# EAGLE design Analog_module_free (EAGLE 7.4.0)
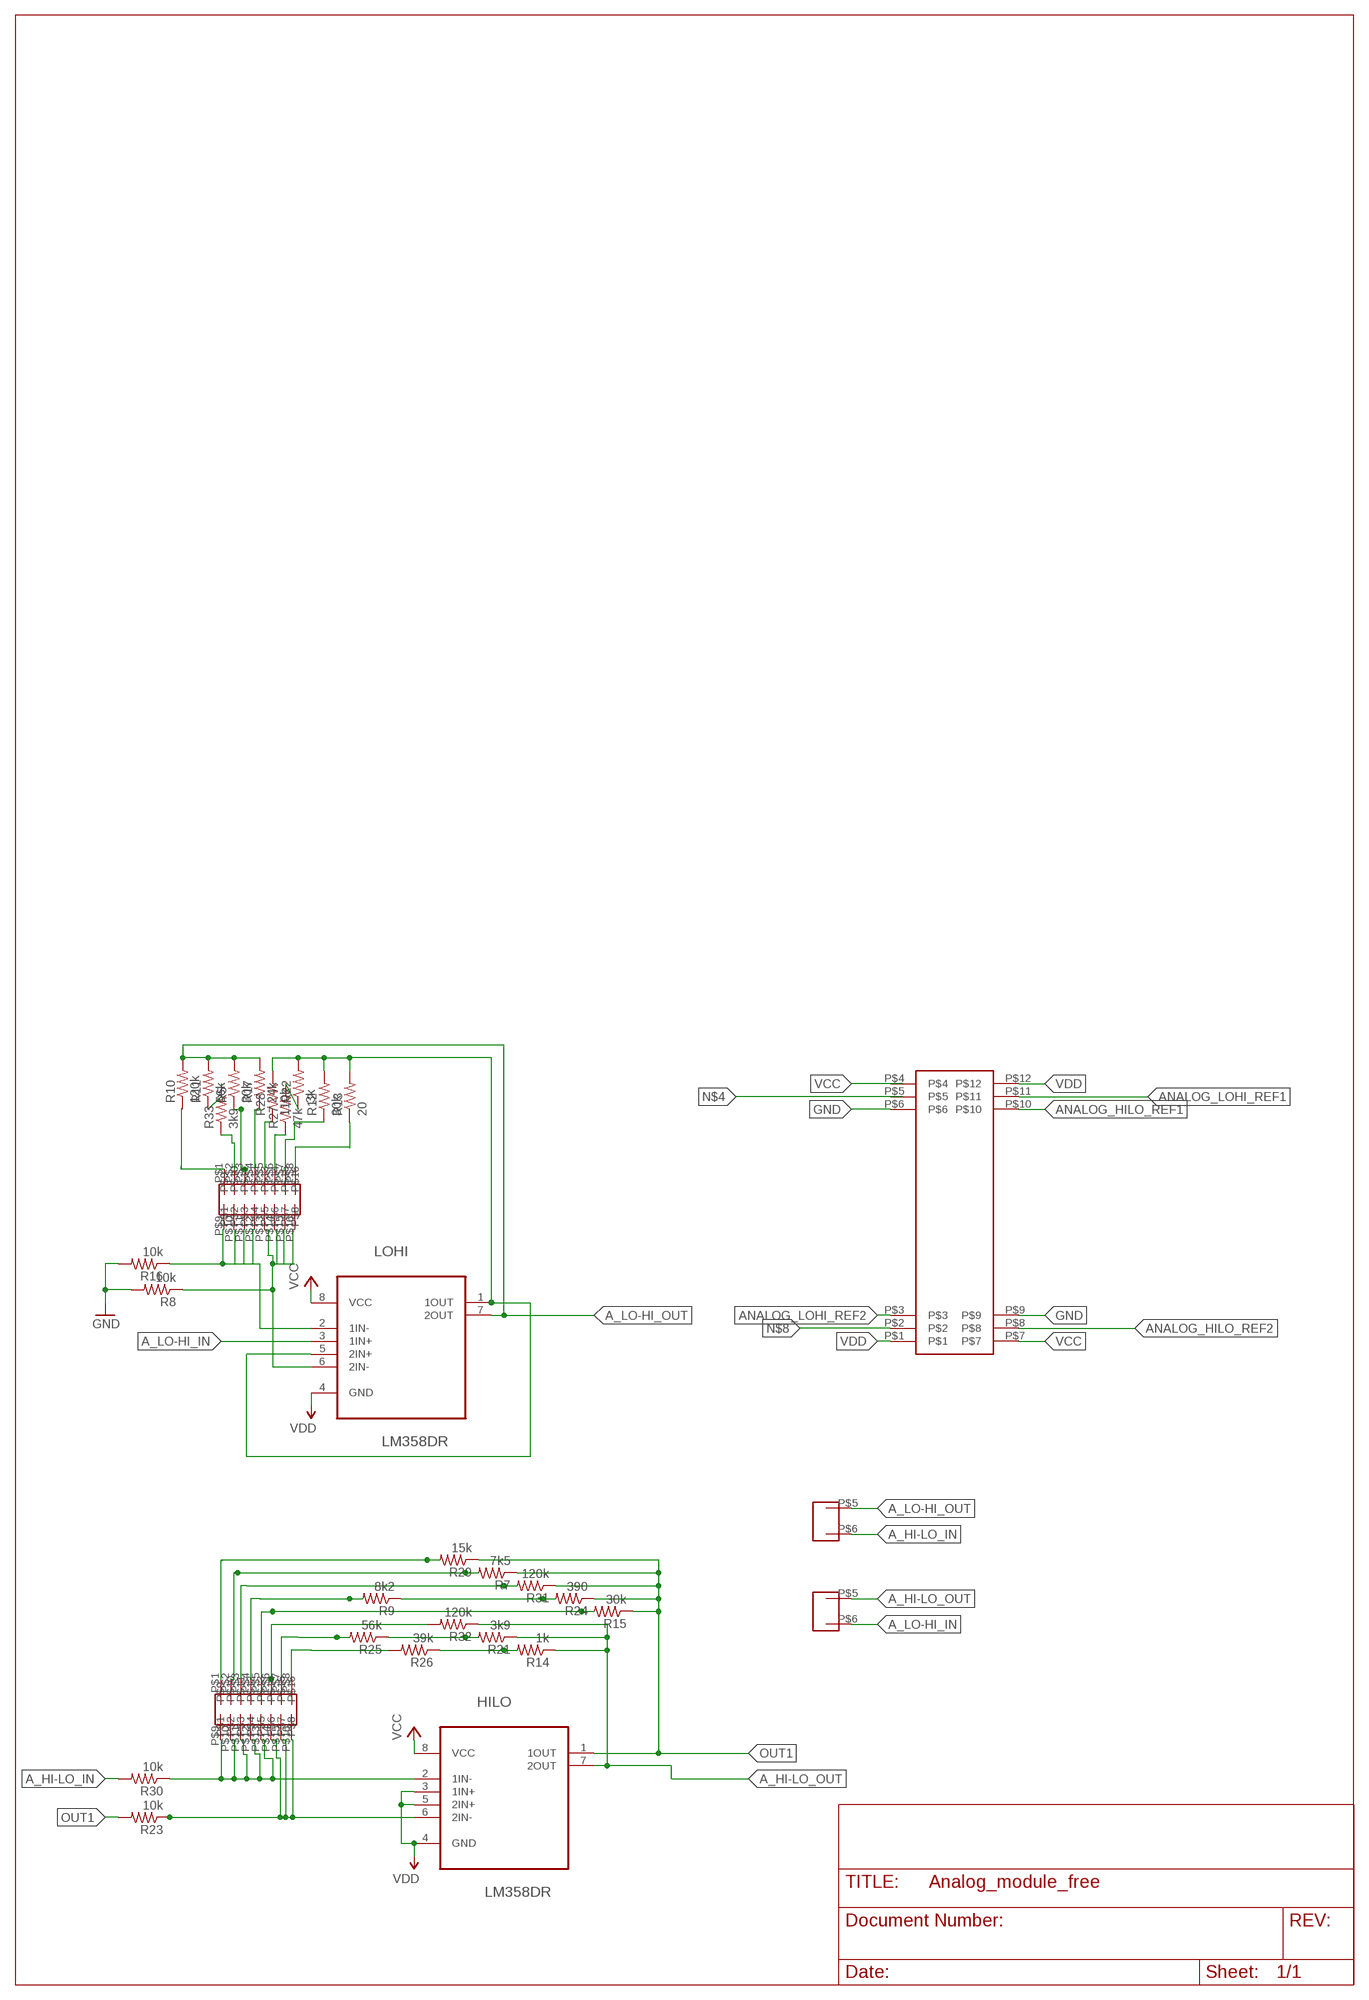
[diagram p0: schematic, sheet 1]

## Parts
HILO  LM358DR  [SOIC127P600X175-8N]
LOHI  LM358DR  [SOIC127P600X175-8N]
R5  30k  R-US_R0805  [R0805]
R7  7k5  R-US_R0805  [R0805]
R8  10k  R-US_R0805  [R0805]
R9  8k2  R-US_R0805  [R0805]
R10  120k  R-US_R0805  [R0805]
R11  56k  R-US_R0805  [R0805]
R12  30k  R-US_R0805  [R0805]
R13  20  R-US_R0805  [R0805]
R14  1k  R-US_R0805  [R0805]
R15  30k  R-US_R0805  [R0805]
R16  10k  R-US_R0805  [R0805]
R17  24k  R-US_R0805  [R0805]
R21  3k9  R-US_R0805  [R0805]
R22  3k  R-US_R0805  [R0805]
R23  10k  R-US_R0805  [R0805]
R24  390  R-US_R0805  [R0805]
R25  56k  R-US_R0805  [R0805]
R26  39k  R-US_R0805  [R0805]
R27  47k  R-US_R0805  [R0805]
R28  110k  R-US_R0805  [R0805]
R29  15k  R-US_R0805  [R0805]
R30  10k  R-US_R0805  [R0805]
R31  120k  R-US_R0805  [R0805]
R32  120k  R-US_R0805  [R0805]
R33  3k9  R-US_R0805  [R0805]
U$1  MODULE_CONNECTOR  [MODULE_CONNECTOR]
U$2  5.08PITCHTERMINAL  [10KPL508]
U$3  5.08PITCHTERMINAL  [10KPL508]
U$4  USCO_8PIN_SWITCH  [USCO_8PIN_SWITCH]
U$5  USCO_8PIN_SWITCH  [USCO_8PIN_SWITCH]

## Nets
A_HI-LO_IN: R30.2 U$2.P$6
A_HI-LO_OUT: HILO.7(2OUT) R14.1 R21.1 R32.1 U$3.P$5
A_LO-HI_IN: LOHI.3(1IN+) U$3.P$6
A_LO-HI_OUT: LOHI.7(2OUT) R5.2 R10.2 R11.2 R17.2 U$2.P$5
ANALOG_HILO_REF1: U$1.P$10
ANALOG_HILO_REF2: U$1.P$8
ANALOG_LOHI_REF1: U$1.P$11
ANALOG_LOHI_REF2: U$1.P$3
GND: R8.2 R16.2 U$1.P$6 U$1.P$9
N$8: U$1.P$2
N$10: HILO.2(1IN-) R30.1
N$13: R27.1
N$21: R13.1
N$22: R29.2
N$23: LOHI.1(1OUT) LOHI.5(2IN+) R12.2 R13.2 R22.2 R28.2
N$24: R7.2
N$26: R31.2 U$5.P$3
N$27: R9.2
N$28: R15.2
N$29: R32.2 U$5.P$6
N$30: HILO.6(2IN-) R23.1
N$31: R25.2
N$32: R26.2
N$34: R14.2 R26.1
N$36: R21.2 R25.1
N$37: R9.1 R24.2
N$38: R22.1 R27.2
N$41: R11.1 R33.2
N$46: LOHI.2(1IN-) R16.1
N$48: U$5.P$7
N$49: U$5.P$8
N$50: LOHI.6(2IN-) R8.1
N$51: U$4.P$5
N$53: U$4.P$7
OUT1: HILO.1(1OUT) R7.1 R15.1 R23.2 R24.1 R29.1 R31.1
VCC: HILO.8(VCC) LOHI.8(VCC) U$1.P$7
VDD: HILO.3(1IN+) HILO.4(GND) HILO.5(2IN+) LOHI.4(GND) U$1.P$1 U$1.P$12
Unconnected: R5.1 R10.1 R12.1 R17.1 R28.1 R33.1 U$1.P$4 U$1.P$5 U$4.P$1 U$4.P$2 U$4.P$3 U$4.P$4 U$4.P$6 U$4.P$8 U$4.P$9 U$4.P$10 U$4.P$11 U$4.P$12 U$4.P$13 U$4.P$14 U$4.P$15 U$4.P$16 U$5.P$1 U$5.P$2 U$5.P$4 U$5.P$5 U$5.P$9 U$5.P$10 U$5.P$11 U$5.P$12 U$5.P$13 U$5.P$14 U$5.P$15 U$5.P$16

## Library data of the parts
HILO LOHI = Texas Instruments_By_element14_Batch_1:LM358DR: OPERATIONAL AMPLIFIERS; MPN: LM358DR; OC_FARNELL: 1831865; OC_NEWARK: 34K7599; PACKAGE: SOIC-8; SUPPLIER: Texas Instruments
R5 R7-R17 R21-R33 = rcl:R-US_: RESISTOR, American symbol
U$1 = UADIVOLECO_module_connector:MODULE_CONNECTOR
U$2 U$3 = ruuviliitin_2pin:5.08PITCHTERMINAL
U$4 U$5 = USCO_8PIN_SWITCH:USCO_8PIN_SWITCH

## Board
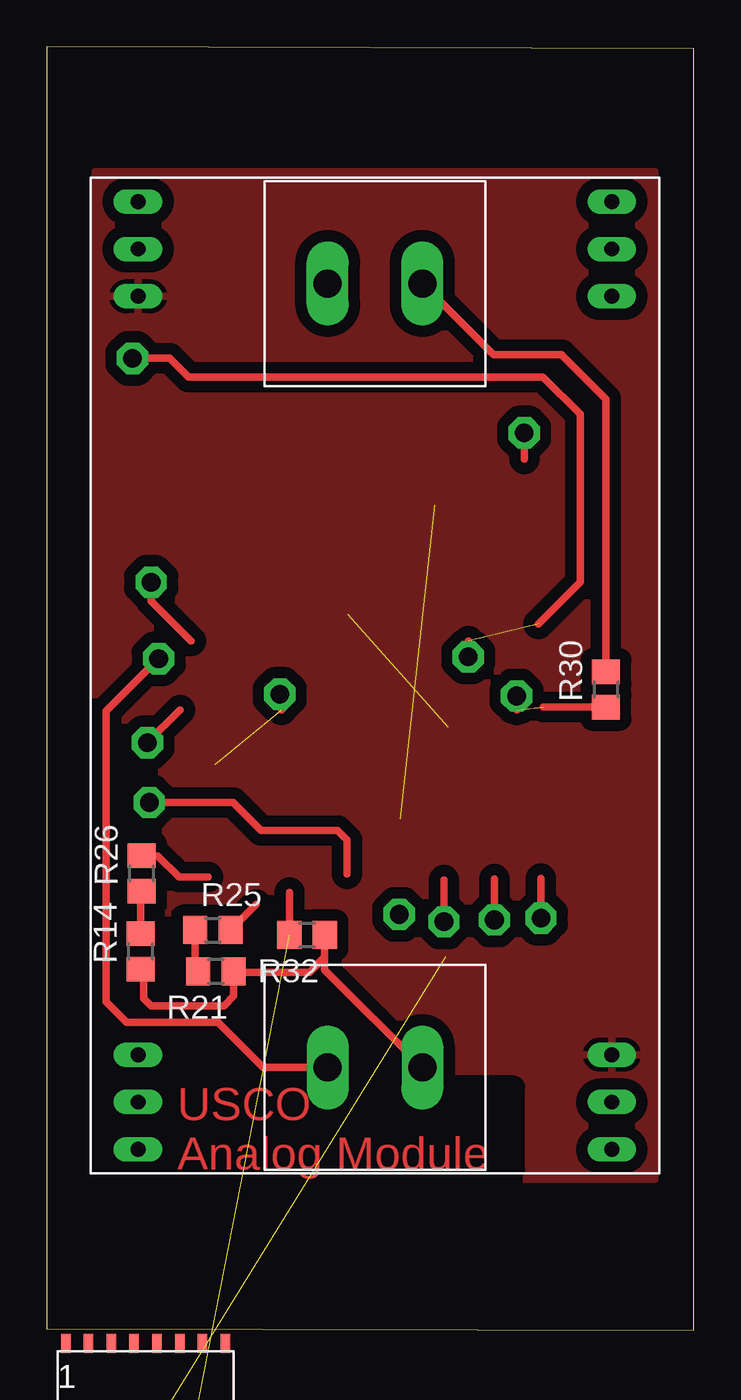
[diagram p1: board, top side]
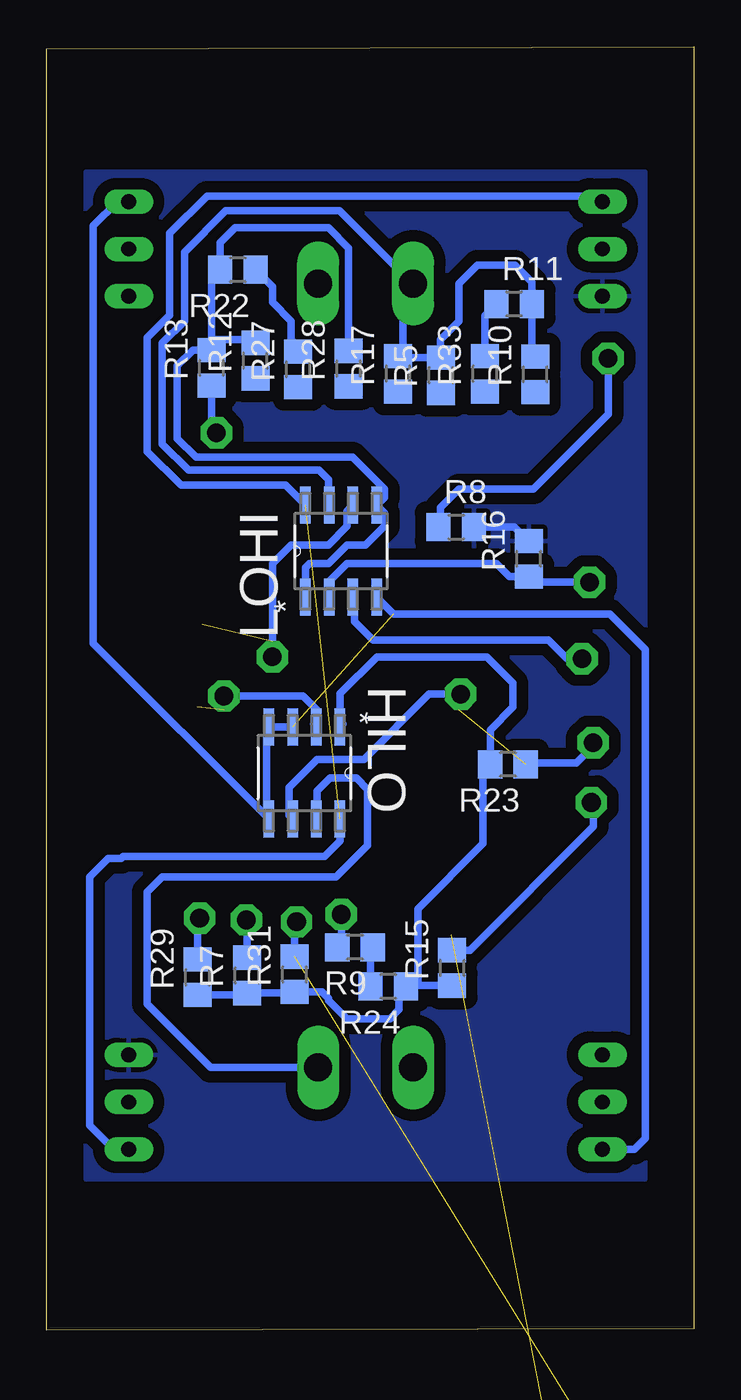
[diagram p2: board, bottom side, seen from below]

Size 34.7 x 68.8 mm. Coordinates in mm from the lower left corner, seen from the top.
Outline: 0,0.1 34.7,0 34.7,68.7 0,68.8 0,0.1
Copper layers (1*16): Top 0.035mm / dielectric 1.5mm / Bottom 0.035mm
Design rules "default": minimum track width 10mil, minimum drill 24mil, track to track 8mil, track to pad 8mil, pad to pad 8mil, via to via 8mil, smd to smd 8mil, copper to edge 40mil, drill to drill 8mil, minimum pad ring 10mil, minimum via ring 8mil, stop-mask expansion 4mil, vias tented up to drill 0mil, thermal gap 10mil

### Footprints (pad centres in the part's own frame; a part is rotated, then mirrored left to right if it is on the bottom)
SOIC127P600X175-8N = smd 1.981 x 0.559: 1 -2.464,1.905; 2 -2.464,0.635; 3 -2.464,-0.635; 4 -2.464,-1.905; 5 2.464,-1.905; 6 2.464,-0.635; 7 2.464,0.635; 8 2.464,1.905
R0805 = smd 1.3 x 1.5: 1 -0.95,0; 2 0.95,0
MODULE_CONNECTOR = drill 0.8 long: P$1 25.4,-12.7; P$2 22.86,-12.7; P$3 20.32,-12.7; P$4 -25.4,-12.7; P$5 -22.86,-12.7; P$6 -20.32,-12.7; P$7 25.4,12.7; P$8 22.86,12.7; P$9 20.32,12.7; P$10 -20.32,12.7; P$11 -22.86,12.7; P$12 -25.4,12.7
10KPL508 = drill 1.5 long: P$5 -2.54,0; P$6 2.54,0
USCO_8PIN_SWITCH = smd 0.508 x 1.016: P$1 -4.27,3.51; P$2 -3.05,3.51; P$3 -1.83,3.51; P$4 -0.61,3.51; P$5 0.61,3.51; P$6 1.83,3.51; P$7 3.05,3.51; P$8 4.27,3.51; P$9 -4.27,-3.51; P$10 -3.05,-3.51; P$11 -1.83,-3.51; P$12 -0.61,-3.51; P$13 0.61,-3.51; P$14 1.83,-3.51; P$15 3.05,-3.51; P$16 4.27,-3.51

### Placement (x,y rotation side)
HILO  20.88,29.87 270 bottom
LOHI  18.92,41.76 90 bottom
R5  13.56,51.19 90 bottom
R7  23.96,19.03 90 bottom
R8  12.75,43.06 0 bottom
R9  18.17,20.54 180 bottom
R10  8.51,51.24 90 bottom
R11  9.64,55.01 0 bottom
R12  23.51,51.98 90 bottom
R13  25.86,51.59 90 bottom
R14  5.04,20.31 90 top
R15  12.96,19.43 90 bottom
R16  8.86,41.35 90 bottom
R17  15.86,51.27 90 bottom
R21  9.07,19.24 180 top
R22  24.45,56.84 180 bottom
R23  9.97,30.34 180 bottom
R24  16.39,18.44 180 bottom
R25  8.91,21.46 0 top
R26  5.09,24.49 90 top
R27  21.21,51.51 90 bottom
R28  18.51,51.54 90 bottom
R29  26.61,18.93 90 bottom
R30  29.99,34.35 90 top
R31  21.41,19.09 90 bottom
R32  13.96,21.19 180 top
R33  11.21,51.27 90 bottom
U$1  17.6,35.1 90 top
U$2  17.6,56.1 0 top
U$3  17.6,14.1 180 top
U$4  5.3,-4.2 0 top
U$5  5.3,-12.5 0 top  (outside the outline)

### Tracks (layer width: path | path; a pad name or v marks a point on that pad's centre or on a via)
A_HI-LO_IN
  Top 0.406: U$2.P$6 23.94,52.3 27.6,52.3 29.99,49.91 R30.2
A_HI-LO_OUT
  Top 0.406: R14.1 5.2,19.2 5.2,17.8 5.6,17.4 9.5,17.4 10.02,17.92 R21.1 10.06,19.2 14.1,19.2 14.91,20.01 | 14.91,20.01 R32.1 | U$3.P$5 14.91,19.33 14.91,20.01
  Bottom 0.406: HILO.7 20.24,27.66 20.2,27.7 20.2,28.9 19.5,29.6 18.1,29.6 17.5,29 17.5,26 19.2,24.3 28.5,24.3 29.3,23.5 29.3,17.5 25.9,14.1 U$3.P$5
A_LO-HI_IN  (via drill 1 pad 1.68)
  Top 0.406: v6,36 3.2,33.2 3.2,17.6 4.3,16.5 9.2,16.5 11.6,14.1 U$3.P$6
  Bottom 0.406: LOHI.3 18.2,39.21 18.2,38 17.2,37 7.8,37 6.8,36 v6,36
A_LO-HI_OUT
  Bottom 0.406: 8.6,52.28 R10.2 8.69,52.37 R11.2 8.69,56.19 9.6,57.1 11.6,57.1 12.6,56.1 12.6,54.1 13.6,53.1 13.6,52.18 R5.2 15.78,52.14 R17.2 15.6,52.48 15.6,54.1 15.06,54.64 U$2.P$5 15.1,56.1 19,60 25.1,60 27.3,57.8 27.3,54.1 28.5,52.9 28.5,47.5 27.1,46.1 20.1,46.1 19.6,45.6 19.6,44.27 LOHI.7
GND
  Bottom 0.406: R16.2 9.62,43.06 R8.2
  pour Bottom (isolate 0.61): 2.6,62.1 2.6,8.1 32.6,8.1 32.6,62.1
  pour Top (isolate 0.61): 2.6,62.1 2.6,8.1 32.6,8.1 32.6,62.1
N$10  (via drill 1 pad 1.68)  (1 unrouted)
  Top 0.406: 26.63,33.4 R30.1 | v25.2,34 25.2,33.25
  Bottom 0.406: 20.4,32.49 HILO.2 20.24,33.29 20.95,34 v25.2,34
N$21  (via drill 1 pad 1.68)
  Top 0.406: 25.6,46.71 v25.6,48.1
  Bottom 0.406: v25.6,48.1 25.86,48.36 R13.1
N$22  (via drill 1 pad 1.68)
  Top 0.406: 26.5,24.23 v26.5,22.1
  Bottom 0.406: v26.5,22.1 26.61,21.99 R29.2
N$23
  Bottom 0.406: R12.2 23.68,53.1 25.6,53.1 25.86,52.84 R13.2 | R13.2 25.86,56.38 R22.2 25.4,58.3 24.6,59.1 19.6,59.1 18.51,58.01 R28.2 | LOHI.1 20.83,40.88 20.6,41.1 19.6,41.1 18.6,42.1 17.6,42.1 16.6,43.1 16.6,43.81 LOHI.5 16.6,44.64 16.6,45.1 18.3,46.8 26.7,46.8 27.7,47.8 27.7,51.7 26.86,52.54 R13.2
N$24  (via drill 1 pad 1.68)
  Top 0.406: 24,24.19 v24,22
  Bottom 0.406: v24,22 23.96,21.96 R7.2
N$26  (via drill 1 pad 1.68)  (1 unrouted)
  Top 0.406: 21.3,24.15 v21.3,21.9
  Bottom 0.406: v21.3,21.9 21.41,21.79 R31.2
N$27  (via drill 1 pad 1.68)
  Top 0.406: v18.9,22.3 18.86,22.34
  Bottom 0.406: R9.2 18.9,20.76 v18.9,22.3
N$28  (via drill 1 pad 1.68)
  Top 0.406: 16.1,24.47 16.1,26.3 15.6,26.8 11.5,26.8 10,28.3 v5.5,28.3
  Bottom 0.406: v5.5,28.3 5.4,28.2 5.4,27 12.02,20.38 R15.2
N$29  (1 unrouted)
  Top 0.406: 13.01,23.48 R32.2
N$30  (via drill 1 pad 1.68)  (1 unrouted)
  Top 0.406: v5.4,31.5 7.15,33.25 | v12.5,34.1 12.6,34 12.6,33.25
  Bottom 0.406: R23.1 8.96,30.4 6.3,30.4 5.4,31.3 v5.4,31.5 | HILO.6 21.7,27.59 21.7,29.1 20.2,30.6 17.7,30.6 14.2,34.1 v12.5,34.1
N$31
  Top 0.406: R25.2 11.24,22.84
N$32
  Top 0.406: 8.65,24.3 7.1,24.3 5.96,25.44 R26.2
N$34
  Top 0.406: R26.1 5.04,23.49 R14.2
N$36
  Top 0.406: R21.2 7.96,19.4 R25.1
N$37
  Bottom 0.406: R9.1 17.34,20.42 R24.2
N$38
  Bottom 0.406: R22.1 22.6,55.94 22.6,55.1 21.6,54.1 21.6,53.1 21.21,52.71 R27.2
N$41
  Bottom 0.406: R11.1 11.21,54.39 R33.2
N$46  (via drill 1 pad 1.68)
  Top 0.406: v5.6,40.1 5.6,39.1 7.75,36.95
  Bottom 0.406: LOHI.2 19.6,39.34 19.6,40.1 18.6,41.1 10.6,41.1 9.9,40.4 R16.1 8.56,40.1 v5.6,40.1
N$50  (via drill 1 pad 1.68)  (1 unrouted)
  Top 0.406: v22.6,36.1 22.6,36.95 | 26.36,37.86 28.6,40.1 28.6,49.1 26.6,51.1 7.6,51.1 6.6,52.1 v4.6,52.1
  Bottom 0.406: LOHI.6 18.6,43.91 18.6,43.1 19.6,42.1 21.6,42.1 22.6,41.1 v22.6,36.1 | R8.1 13.6,43.16 13.6,44.1 12.6,45.1 8.6,45.1 4.6,49.1 v4.6,52.1
OUT1
  Bottom 0.406: 14.8,18.48 15.4,18.48 R24.1 15.8,18.08 15.8,17.2 16.3,16.7 18.6,16.7 19.6,17.7 19.6,17.8 19.94,18.14 R31.1 21.47,18.08 R7.1 24.06,17.98 R29.1 | 14.8,18.48 R15.1 | 18.8,32.51 HILO.1 18.98,34.12 17,36.1 11.1,36.1 9.7,34.7 9.7,33.4 10.92,32.18 R23.2 11.3,29.96 11.3,26.1 14.8,22.6 14.8,18.48
VCC  (1 unrouted)
  Bottom 0.406: LOHI.8 21.9,45.3 27.5,45.3 29.3,47.1 29.3,53.2 28.1,54.4 28.1,58.8 26.1,60.8 5.3,60.8 5,60.5 U$1.P$7 | HILO.8 18.98,26.23 19.8,25.4 30.6,25.4 30.7,25.3 31.4,25.3 32.4,24.3 32.4,11 31.1,9.7 30.4,9.7 | 30.4,9.7 30.3,9.7 30.2,9.6 30.3,9.6 30.4,9.7
VDD  (1 unrouted)
  Bottom 0.406: HILO.3 HILO.4 22.9,32.22 22.9,26.8 22.78,26.91 HILO.5 32.2,36.82 32.2,59.2 30.9,60.5 U$1.P$1 | LOHI.4 16.12,38.4 4.5,38.4 2.6,36.5 2.6,10.3 3.2,9.7 U$1.P$12

### Text on the board
Top: USCO / Analog Module